# EAGLE design led (EAGLE 6.4)
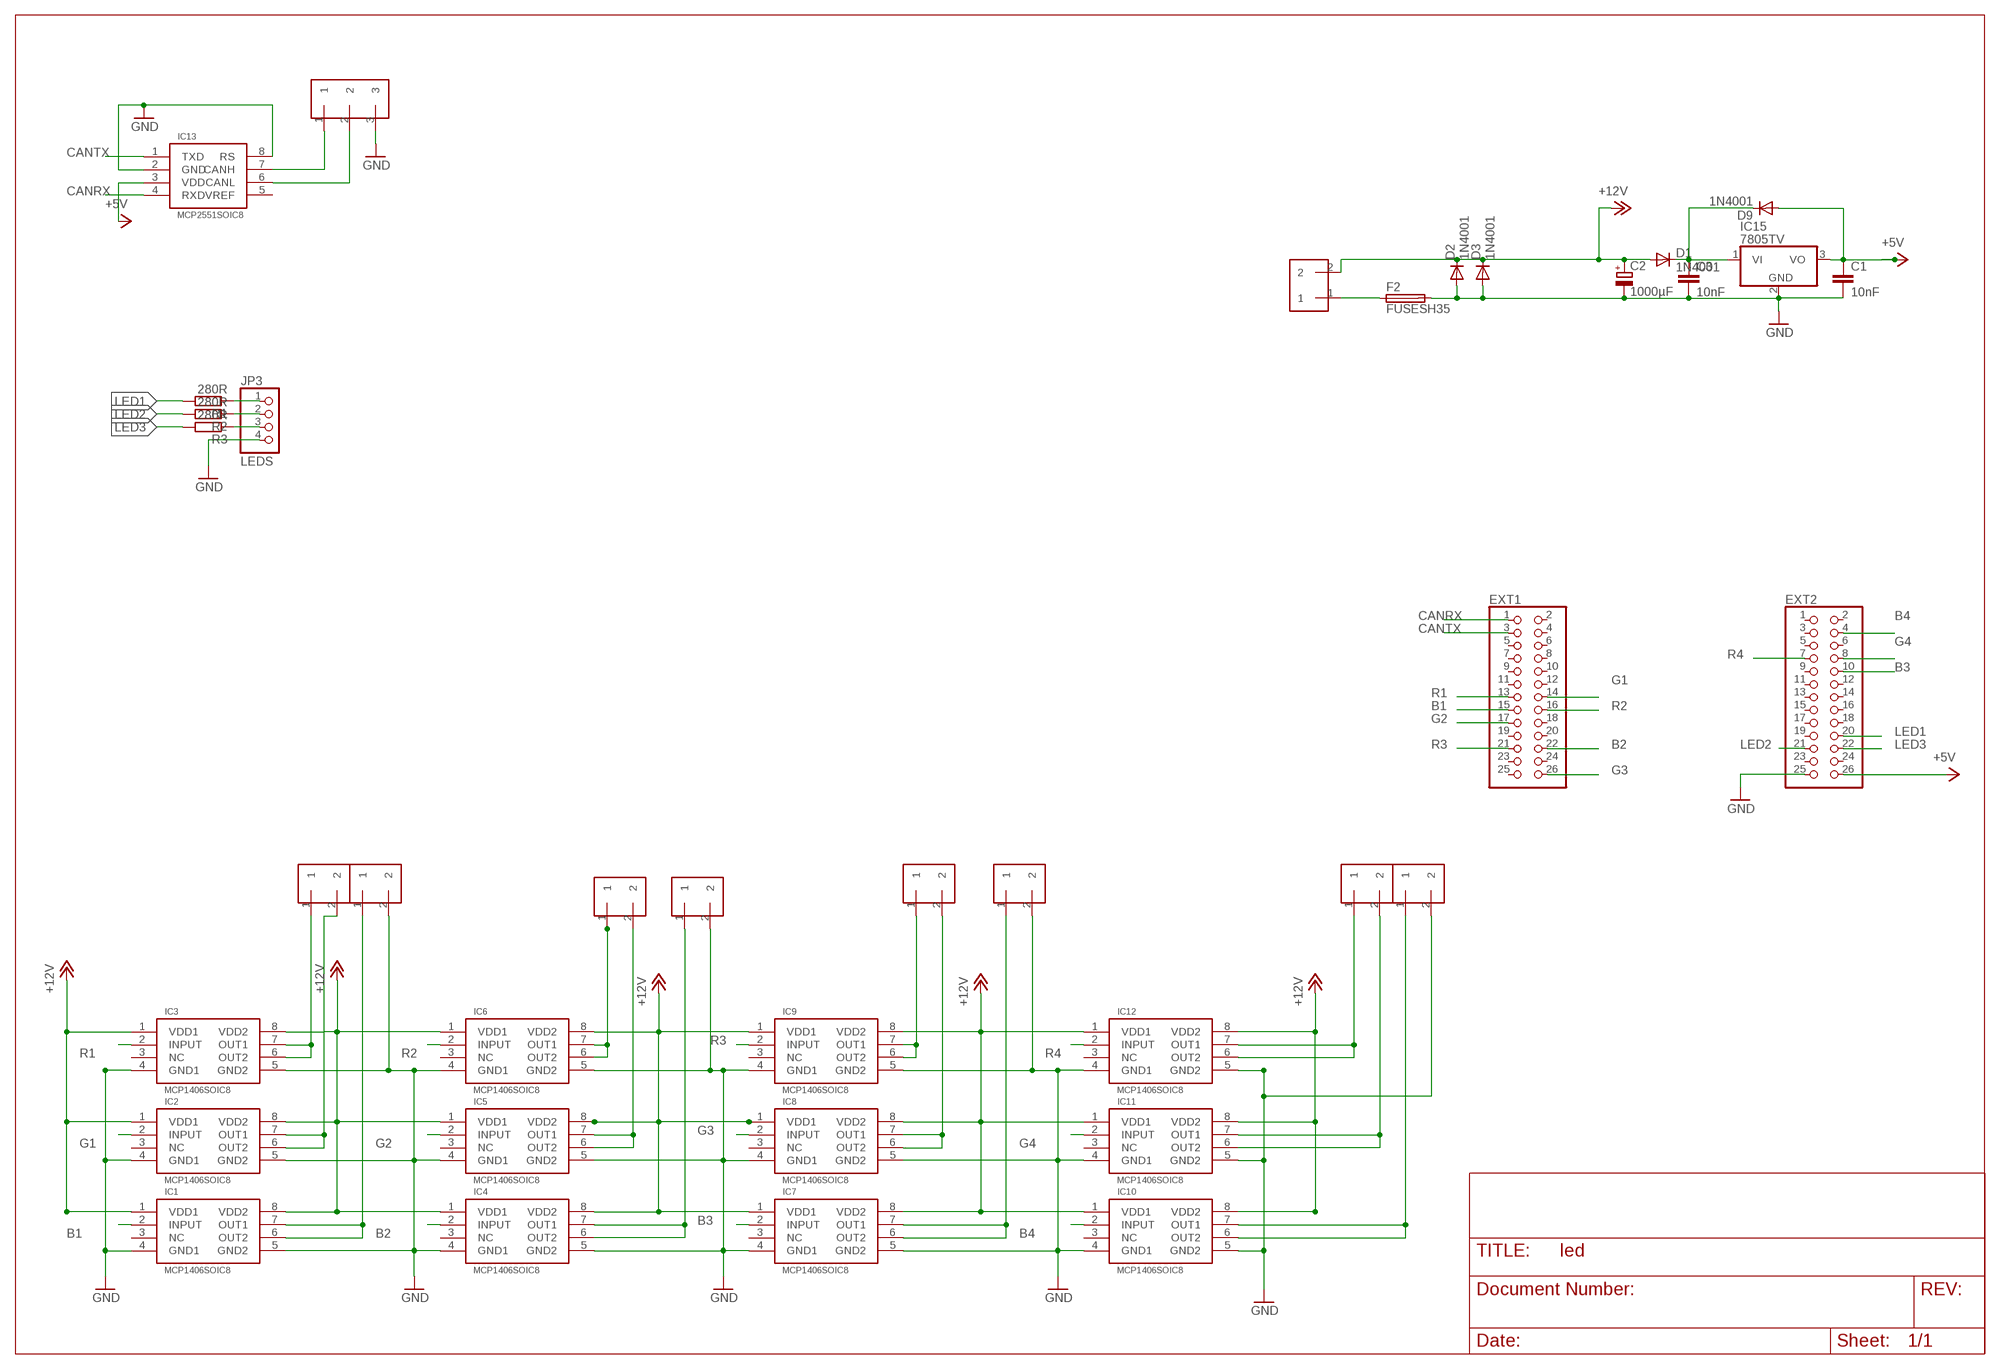
[diagram p0: schematic, sheet 1]

## Parts
C1  10nF  C-EU025-025X050  [C025-025X050]
C2  1000µF  CPOL-EUE5-8.5  [E5-8,5]
C3  10nF  C-EU025-025X050  [C025-025X050]
D1  1N4001  DIODE-MELF-MLL41  [MELF-MLL41]
D2  1N4001  DIODE-MELF-MLL41  [MELF-MLL41]
D3  1N4001  DIODE-MELF-MLL41  [MELF-MLL41]
D9  1N4001  DIODE-MELF-MLL41  [MELF-MLL41]
EXT1  PINHD-2X13  [2X13]
EXT2  PINHD-2X13  [2X13]
F2  FUSESH35  [SH25]
IC1  MCP1406SOIC8  [SOIC-08LG]
IC2  MCP1406SOIC8  [SOIC-08LG]
IC3  MCP1406SOIC8  [SOIC-08LG]
IC4  MCP1406SOIC8  [SOIC-08LG]
IC5  MCP1406SOIC8  [SOIC-08LG]
IC6  MCP1406SOIC8  [SOIC-08LG]
IC7  MCP1406SOIC8  [SOIC-08LG]
IC8  MCP1406SOIC8  [SOIC-08LG]
IC9  MCP1406SOIC8  [SOIC-08LG]
IC10  MCP1406SOIC8  [SOIC-08LG]
IC11  MCP1406SOIC8  [SOIC-08LG]
IC12  MCP1406SOIC8  [SOIC-08LG]
IC13  MCP2551SOIC8  [SOIC-08LG]
IC15  7805TV  [TO220V]
JP3  LEDS  PINHD-1X4  [1X04]
R1  280R  R-EU_0204/7  [0204/7]
R2  280R  R-EU_0204/7  [0204/7]
R3  280R  R-EU_0204/7  [0204/7]
U$1  2KLEMME  [W237-102]
U$2  2KLEMME  [W237-102]
U$3  3KLEMME  [W237-103]
U$5  2KLEMME  [W237-102]
U$6  2KLEMME  [W237-102]
U$7  2KLEMME  [W237-102]
U$8  2KLEMME  [W237-102]
U$9  2KLEMME  [W237-102]
U$10  2KLEMME  [W237-102]
U$11  2KLEMME  [W237-102]

## Nets
+5V: C1.1 D9.A EXT2.26 IC13.3(VDD) IC15.3(VO)
+12V: C2.+ D1.A D2.C D3.C IC1.1(VDD1) IC1.8(VDD2) IC2.1(VDD1) IC2.8(VDD2) IC3.1(VDD1) IC3.8(VDD2) IC4.1(VDD1) IC4.8(VDD2) IC5.1(VDD1) IC5.8(VDD2) IC6.1(VDD1) IC6.8(VDD2) IC7.1(VDD1) IC7.8(VDD2) IC8.1(VDD1) IC8.8(VDD2) IC9.1(VDD1) IC9.8(VDD2) IC10.1(VDD1) IC10.8(VDD2) IC11.1(VDD1) IC11.8(VDD2) IC12.1(VDD1) IC12.8(VDD2) U$1.2
B1: EXT1.15 IC1.2(INPUT)
B2: EXT1.22 IC4.2(INPUT)
B3: EXT2.10 IC7.2(INPUT)
B4: EXT2.4 IC10.2(INPUT)
CANH: IC13.7(CANH) U$3.1
CANL: IC13.6(CANL) U$3.2
CANRX: EXT1.1 IC13.4(RXD)
CANTX: EXT1.3 IC13.1(TXD)
G1: EXT1.14 IC2.2(INPUT)
G2: EXT1.17 IC5.2(INPUT)
G3: EXT1.26 IC8.2(INPUT)
G4: EXT2.8 IC11.2(INPUT)
GND: C1.2 C2.- C3.2 D2.A D3.A EXT2.25 F2.2 IC1.4(GND1) IC1.5(GND2) IC2.4(GND1) IC2.5(GND2) IC3.4(GND1) IC3.5(GND2) IC4.4(GND1) IC4.5(GND2) IC5.4(GND1) IC5.5(GND2) IC6.4(GND1) IC6.5(GND2) IC7.4(GND1) IC7.5(GND2) IC8.4(GND1) IC8.5(GND2) IC9.4(GND1) IC9.5(GND2) IC10.4(GND1) IC10.5(GND2) IC11.4(GND1) IC11.5(GND2) IC12.4(GND1) IC12.5(GND2) IC13.2(GND) IC13.8(RS) IC15.2(GND) JP3.4 U$2.2 U$3.3 U$6.2 U$7.2 U$11.2
LED1: EXT2.20 R1.2
LED2: EXT2.21 R2.2
LED3: EXT2.22 R3.2
N$1: C3.1 D1.C D9.C IC15.1(VI)
N$2: F2.1 U$1.1
N$3: IC3.6(OUT2) IC3.7(OUT1) U$5.1
N$4: IC2.6(OUT2) IC2.7(OUT1) U$5.2
N$5: IC1.6(OUT2) IC1.7(OUT1) U$6.1
N$6: IC6.6(OUT2) IC6.7(OUT1) U$10.1
N$7: IC5.6(OUT2) IC5.7(OUT1) U$10.2
N$8: IC4.6(OUT2) IC4.7(OUT1) U$11.1
N$9: IC9.6(OUT2) IC9.7(OUT1) U$8.1
N$10: IC8.6(OUT2) IC8.7(OUT1) U$8.2
N$11: IC7.6(OUT2) IC7.7(OUT1) U$7.1
N$12: IC12.6(OUT2) IC12.7(OUT1) U$9.1
N$13: IC11.6(OUT2) IC11.7(OUT1) U$9.2
N$14: IC10.6(OUT2) IC10.7(OUT1) U$2.1
N$32: JP3.1 R1.1
N$36: JP3.2 R2.1
N$37: JP3.3 R3.1
R1: EXT1.13 IC3.2(INPUT)
R2: EXT1.16 IC6.2(INPUT)
R3: EXT1.21 IC9.2(INPUT)
R4: EXT2.7 IC12.2(INPUT)
Unconnected: EXT1.2 EXT1.4 EXT1.5 EXT1.6 EXT1.7 EXT1.8 EXT1.9 EXT1.10 EXT1.11 EXT1.12 EXT1.18 EXT1.19 EXT1.20 EXT1.23 EXT1.24 EXT1.25 EXT2.1 EXT2.2 EXT2.3 EXT2.5 EXT2.6 EXT2.9 EXT2.11 EXT2.12 EXT2.13 EXT2.14 EXT2.15 EXT2.16 EXT2.17 EXT2.18 EXT2.19 EXT2.23 EXT2.24 IC1.3(NC) IC2.3(NC) IC3.3(NC) IC4.3(NC) IC5.3(NC) IC6.3(NC) IC7.3(NC) IC8.3(NC) IC9.3(NC) IC10.3(NC) IC11.3(NC) IC12.3(NC) IC13.5(VREF)

## Library data of the parts
C1 C3 = rcl:C-EU: CAPACITOR, European symbol
C2 = rcl:CPOL-EU: POLARIZED CAPACITOR, European symbol
D1-D3 D9 = diode:DIODE-: DIODE
EXT1 EXT2 = pinhead:PINHD-2X13: PIN HEADER
F2 = fuse:FUSE: Fuse; OC_FARNELL: unknown; OC_NEWARK: unknown
IC1-IC12 = custom-parts:MCP1406
IC13 = custom-parts:MCP2551
IC15 = linear:78*: Positive VOLTAGE REGULATOR Source: http://cache.national.com/ds/LM/LM78L05.pdf http://www.fairchildsemi.com/ds/LM/LM7805.pdf
JP3 = pinhead:PINHD-1X4: PIN HEADER
R1-R3 = rcl:R-EU_: RESISTOR, European symbol
U$1 U$2 U$5-U$11 = custom-parts:2KLEMME
U$3 = custom-parts:3KLEMME

## Board
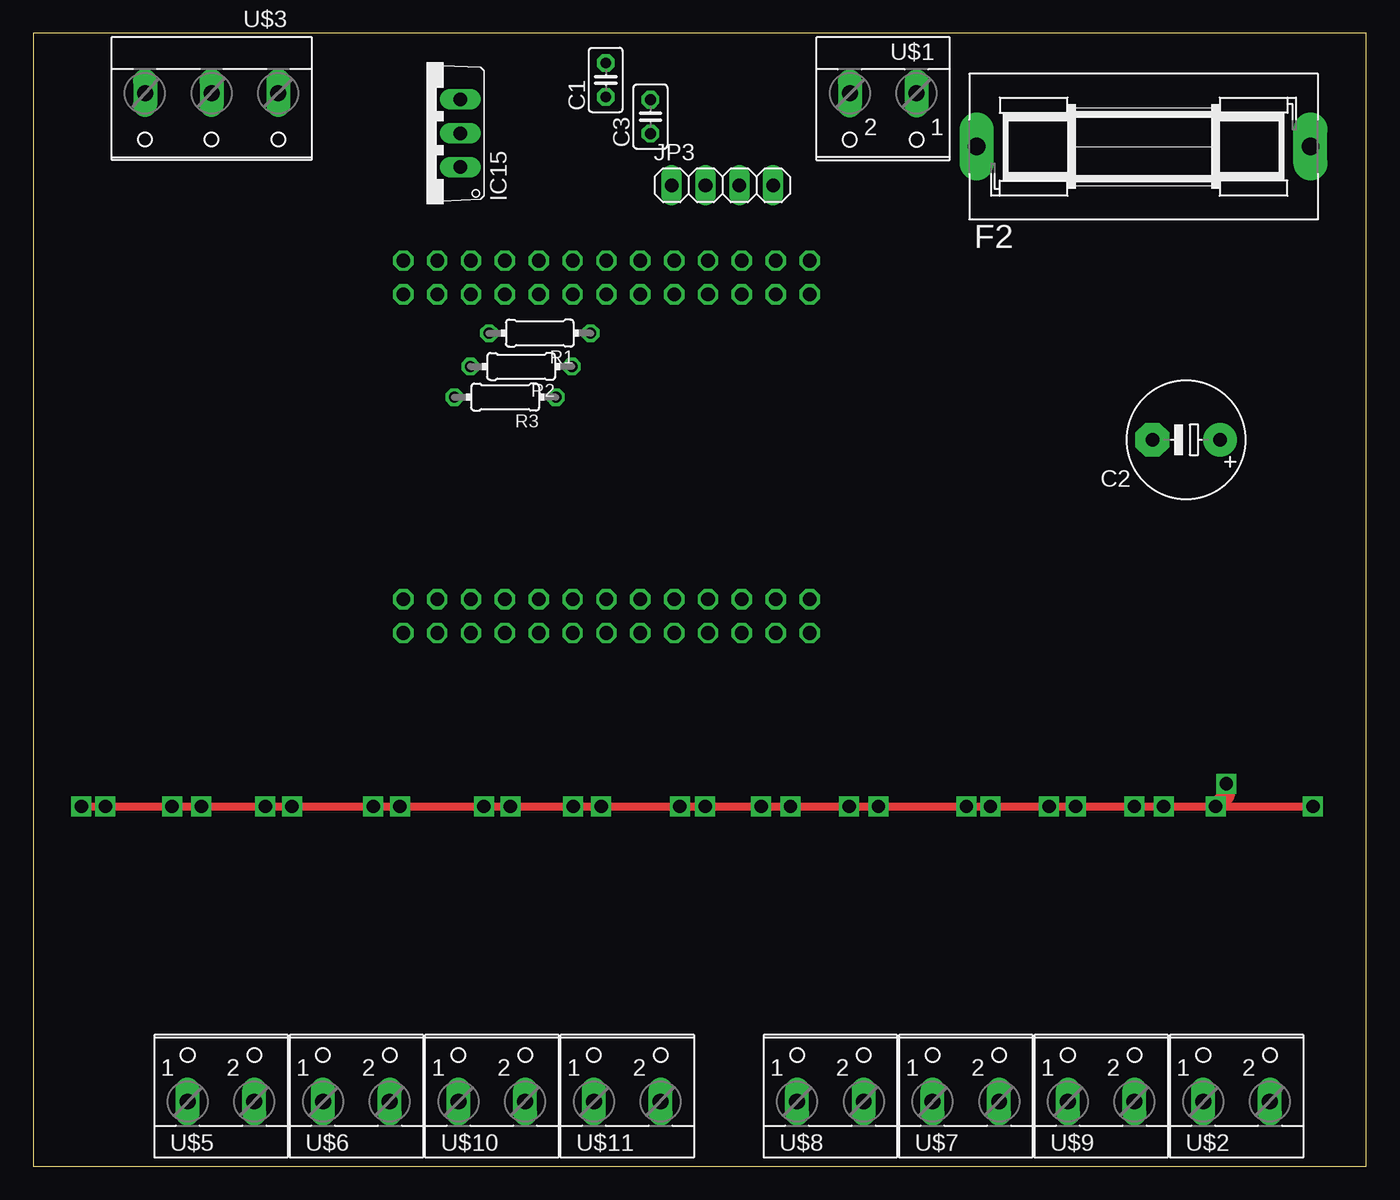
[diagram p1: board, top side]
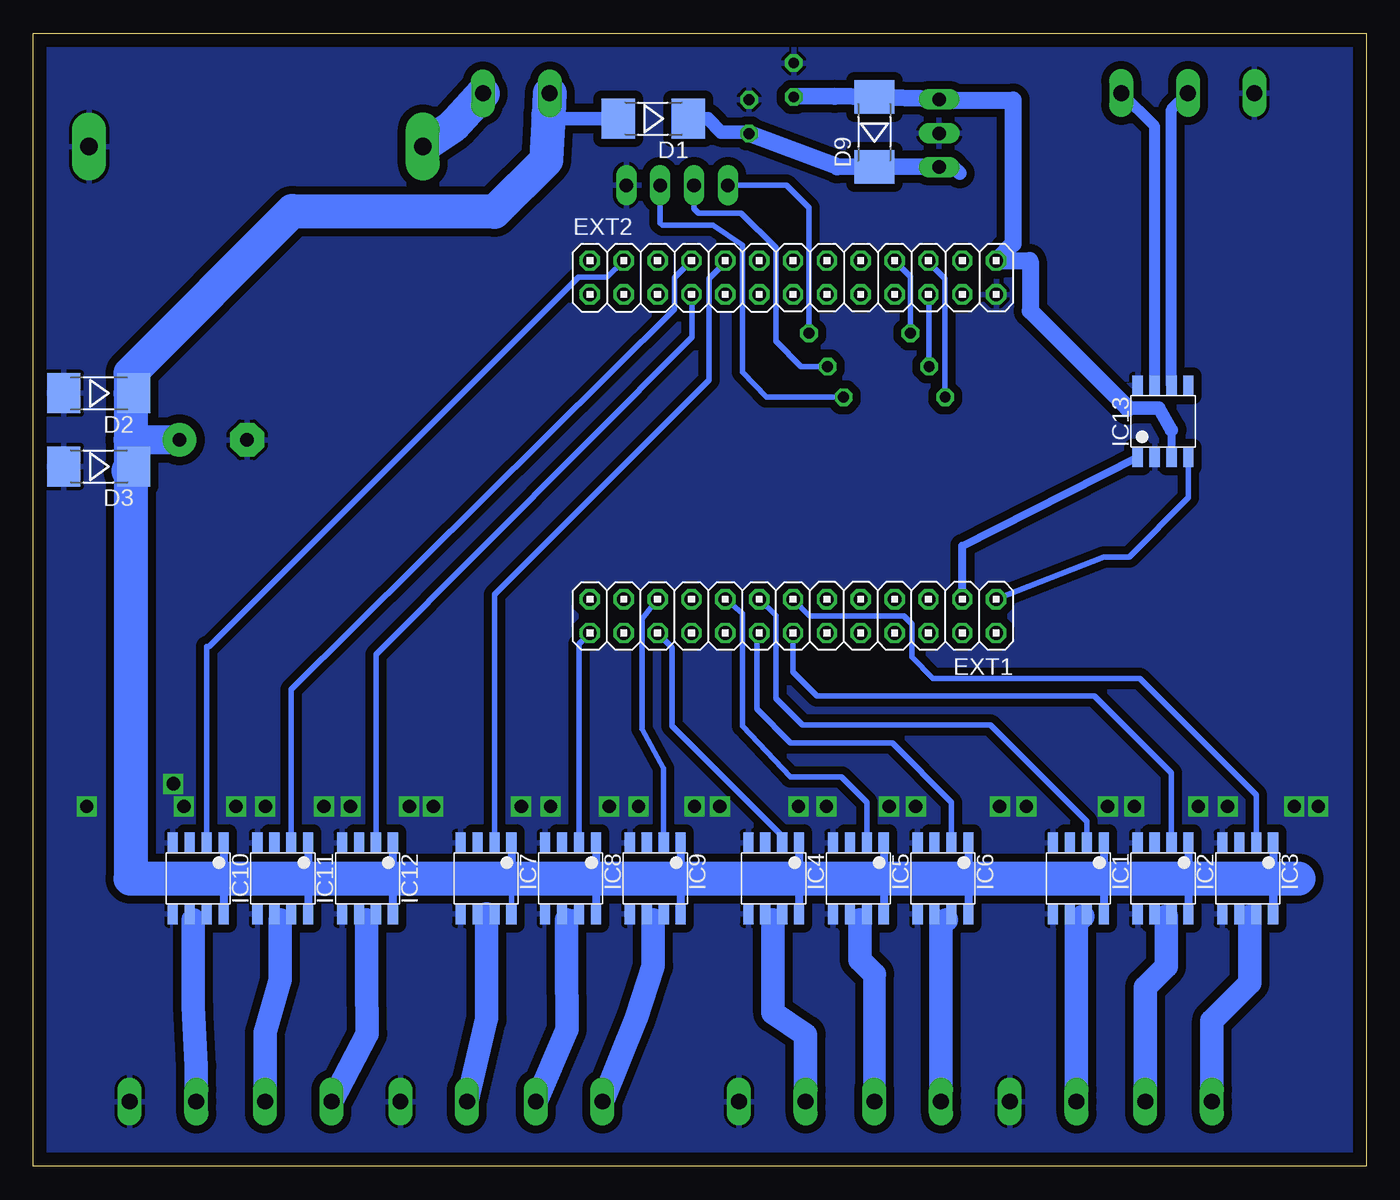
[diagram p2: board, bottom side, seen from below]

Size 100 x 85 mm. Coordinates in mm from the lower left corner, seen from the top.
Outline: 0,0 100,0 100,85 0,85 0,0
Copper layers (1*16): Top 0.035mm / dielectric 1.5mm / Bottom 0.035mm
Design rules "default": minimum track width 10mil, minimum drill 24mil, track to track 8mil, track to pad 8mil, pad to pad 8mil, via to via 8mil, smd to smd 8mil, copper to edge 40mil, drill to drill 8mil, minimum pad ring 10mil, minimum via ring 8mil, stop-mask expansion 4mil, vias tented up to drill 0mil, thermal gap 10mil

### Footprints (pad centres in the part's own frame; a part is rotated, then mirrored left to right if it is on the bottom)
C025-025X050 = drill 0.813 octagon: 1 -1.27,0; 2 1.27,0
E5-8,5 = drill 1.016 pad 2.54: + -2.54,0 | drill 1.016 pad 2.54 octagon: - 2.54,0
MELF-MLL41 = smd 2.5 x 3: A 2.625,0; C -2.625,0
2X13 = drill 1.016 octagon: 1 -15.24,-1.27; 2 -15.24,1.27; 3 -12.7,-1.27; 4 -12.7,1.27; 5 -10.16,-1.27; 6 -10.16,1.27; 7 -7.62,-1.27; 8 -7.62,1.27; 9 -5.08,-1.27; 10 -5.08,1.27; 11 -2.54,-1.27; 12 -2.54,1.27; 13 0,-1.27; 14 0,1.27; 15 2.54,-1.27; 16 2.54,1.27; 17 5.08,-1.27; 18 5.08,1.27; 19 7.62,-1.27; 20 7.62,1.27; 21 10.16,-1.27; 22 10.16,1.27; 23 12.7,-1.27; 24 12.7,1.27; 25 15.24,-1.27; 26 15.24,1.27
SH25 = drill 1.321 pad 2.54 long: 1 -12.522,0; 2 12.522,0
SOIC-08LG = smd 0.762 x 1.524: 1 -1.905,-2.675; 2 -0.635,-2.675; 3 0.635,-2.675; 4 1.905,-2.675; 5 1.905,2.675; 6 0.635,2.675; 7 -0.635,2.675; 8 -1.905,2.675
TO220V = drill 1.016 long: 1 -2.54,-2.54; 2 0,-2.54; 3 2.54,-2.54
1X04 = drill 1.016 long: 1 -3.81,0; 2 -1.27,0; 3 1.27,0; 4 3.81,0
0204/7 = drill 0.813 octagon: 1 -3.81,0; 2 3.81,0
W237-102 = drill 1.194 long: 1 -2.5,0; 2 2.5,0
W237-103 = drill 1.194 long: 1 -5,-0.02; 2 0,-0.02; 3 5,-0.02

### Placement (x,y rotation side)
C1  42.95,81.5 90 top
C2  86.5,54.5 180 top
C3  46.3,78.75 90 top
D1  53.5,78.6 180 bottom
D2  95.1,58 180 bottom
D3  95.1,52.5 180 bottom
D9  36.9,77.6 90 bottom
EXT1  43,41.27 180 bottom
EXT2  43,66.67 0 bottom
F2  83.3,76.5 0 top
IC1  21.59,21.59 180 bottom
IC2  15.24,21.59 180 bottom
IC3  8.89,21.59 180 bottom
IC4  44.45,21.59 180 bottom
IC5  38.1,21.59 180 bottom
IC6  31.75,21.59 180 bottom
IC7  66.04,21.59 180 bottom
IC8  59.69,21.59 180 bottom
IC9  53.34,21.59 180 bottom
IC10  87.63,21.59 180 bottom
IC11  81.28,21.59 180 bottom
IC12  74.93,21.59 180 bottom
IC13  15.24,55.88 0 bottom
IC15  29.5,77.5 90 top
JP3  51.7,73.6 0 top
R1  38,62.5 180 top
R2  36.6,60 180 top
R3  35.4,57.7 180 top
U$1  63.76,80.5 180 top
U$2  90.28,4.85 0 top
U$3  13.38,80.5 180 top
U$5  14.08,4.85 0 top
U$6  24.24,4.85 0 top
U$7  69.96,4.85 0 top
U$8  59.8,4.85 0 top
U$9  80.12,4.85 0 top
U$10  34.4,4.85 0 top
U$11  44.56,4.85 0 top

### Tracks (layer width: path | path; a pad name or v marks a point on that pad's centre or on a via)
+5V
  Bottom 0.406: IC15.3 31,80.04 D9.A
  Bottom 0.61: 14.61,55.24 IC13.3
  Bottom 1.016: 17.9,56.88 15.54,56.88 14.61,55.24
  Bottom 1.27: IC15.3 39.89,80.27 C1.1 | 31,80.04 31,80 26.5,80 26.5,69.2 EXT2.26 25.25,67.94 25.2,67.9 25.2,64.18 17.9,56.88
+12V
  Bottom 0.406: IC7.8 IC7.1
  Bottom 0.61: IC3.1 IC3.8 6.99,21.59 7.62,21.59 | IC2.8 IC2.1 13.34,21.59 13.97,21.59 | IC1.8 IC1.1 19.68,21.59 20.32,21.59 | IC6.8 IC6.1 29.84,21.59 30.48,21.59 | IC5.8 IC5.1 36.2,21.59 36.83,21.59 | IC4.8 IC4.1 42.55,21.59 43.18,21.59 | IC9.8 IC9.1 51.44,21.59 50.8,21.59 | IC8.8 IC8.1 57.78,21.59 58.42,21.59 | IC12.8 IC12.1 73.03,21.59 73.66,21.59 | IC11.8 IC11.1 79.38,21.59 80.01,21.59 | IC10.8 IC10.1 85.72,21.59 85.09,21.59 | IC7.1 64.14,21.59 64.77,21.59
  Bottom 1.016: D1.A 61.09,78.6 61.36,78.87
  Bottom 2.184: C2.+ 92.71,54.5
  Bottom 2.54: 92.71,58 92.71,59.5 80.61,71.61 | 92.71,58 92.71,54.5 92.71,52 | 92.71,52 92.71,21.59 85.09,21.59 80.01,21.59 73.66,21.59 64.77,21.59 58.42,21.59 50.8,21.59 43.18,21.59 36.83,21.59 30.48,21.59 20.32,21.59 13.97,21.59 7.62,21.59 5.08,21.59 | 80.55,71.66 80.61,71.61 | D2.C 92.71,58 | D3.C 92.88,52.16 92.71,52 | U$1.2 61.36,78.87 61.55,75.55 61.5,75.5 65.39,71.61 80.61,71.61
B1
  Bottom 0.406: EXT1.15 44.3,41.3 44.3,35.1 42.3,33.1 28.2,33.1 20.95,25.86 IC1.2
B2
  Bottom 0.406: EXT1.22 52.07,38.91 52.07,33.02 43.81,24.77 IC4.2
B3
  Bottom 0.406: EXT2.10 48.08,67.82 49.3,66.6 49.3,59 65.4,42.9 IC7.2
B4
  Bottom 0.406: IC10.2 87,39.01 86.8,39.01 59.1,66.7 56.95,66.7 EXT2.4
CANH
  Bottom 0.813: IC13.7 15.88,78.02 U$3.1
CANL
  Bottom 0.813: IC13.6 14.61,79.3 U$3.2
CANRX
  Bottom 0.406: EXT1.1 19.68,45.72 17.78,45.72 13.34,50.16 IC13.4
CANTX
  Bottom 0.61: EXT1.3 30.3,46.55 IC13.1
G1
  Bottom 0.406: EXT1.14 43,37.1 41.2,35.3 20.4,35.3 14.61,29.5 IC2.2
G2
  Bottom 0.406: EXT1.17 46.79,41.45 46.79,33.02 43.18,29.21 39.37,29.21 37.47,27.3 IC5.2
G3
  Bottom 0.406: EXT1.26 59.05,39.19 IC8.2
G4
  Bottom 0.406: EXT2.8 51.9,66.67 51.9,64.3 80.64,35.76 IC11.2
GND  (via drill 1 pad 1.27)
  Top 0.61: v3.6,27 v5.4,27 v10.4,27 v12.6,27 v17.4,27 v19.4,27 v25.5,27 v27.5,27 v33.8,27 v35.8,27 v40.5,27 v42.6,27 v48.5,27 v50.4,27 v54.6,27 v56.8,27 v61.2,27 v63.4,27 v70,27 v71.8,27 v76.2,27 v78.2,27 v82.6,27 v84.8,27 v88.7,27 v96,27
  Top 1.27: v89.5,28.7 89.5,27.8 v88.7,27
  pour Bottom (isolate 0.61): -5.08,90.17 104.14,88.9 104.14,-13.97 -5.08,-12.7
LED1
  Bottom 0.406: R1.2 34.19,66.75 EXT2.20
LED2
  Bottom 0.406: R2.2 32.79,65.36 EXT2.21
LED3
  Bottom 0.406: EXT2.22 32.84,67.84 31.6,66.6 R3.2
N$1
  Bottom 1.016: IC15.1 31,74.96 | 31,74.96 30.96,74.96 30.5,74.5 | D9.C 31,74.96 | D1.C 49.4,78.6 48.4,77.6 46.42,77.6 C3.1
  Bottom 1.27: IC15.1 39.68,74.98 C3.1
N$2
  Bottom 2.54: U$1.1 68.56,78 F2.1
N$3
  Bottom 0.61: IC3.6 8.91,18.91 8.75,18.75 8.42,18.75 IC3.7
  Bottom 1.778: U$5.1 11.58,10.92 8.75,13.75 8.75,18.75
N$4
  Bottom 0.61: IC2.7 14.84,18.91 15,18.75 15.71,18.75 IC2.6
  Bottom 1.778: U$5.2 16.58,13.42 15,15 15,18.75
N$5
  Bottom 0.61: 21.25,18.75 21.12,18.75 IC1.7 IC1.6
  Bottom 1.778: U$6.1 21.74,18.26 21.25,18.75
N$6
  Bottom 0.61: 31.5,18.5 31.5,18.53 IC6.7 IC6.6
  Bottom 1.778: U$10.1 31.9,18.1 31.5,18.5
N$7
  Bottom 0.61: IC5.6 38.59,18.91 38.5,19 37.55,19 IC5.7 37.59,18.91 38,18.5
  Bottom 1.676: 36.9,14.4 U$10.2
  Bottom 1.778: 36.9,14.4 38,15.5 38,18.5
N$8
  Bottom 0.61: IC4.7 IC4.6 44.91,18.91 44.5,18.5
  Bottom 1.778: U$11.1 42.06,9.86 44.5,11.5 44.5,18.5
N$9
  Bottom 0.61: IC9.7 IC9.6 53.91,18.91 53.5,18.5
  Bottom 1.778: U$8.1 54.76,11.18 53.5,15 53.5,18.5
N$10
  Bottom 0.61: 60,18.5 60,19 | 60,19 59.14,19 IC8.7 | IC8.6 60.09,18.91 60,19
  Bottom 1.778: U$8.2 59.96,10.28 60,15.5 60,18.5
N$11
  Bottom 0.406: IC7.7 66,18.91 IC7.6
  Bottom 1.778: U$7.1 65.98,11.08 66,14.5 66,18.91
N$12
  Bottom 0.61: 75,18.5 75.42,18.91 IC12.6 IC12.7
  Bottom 1.778: U$9.1 74.94,9.94 75,14 75,18.5
N$13
  Bottom 0.61: IC11.7 81.08,18.91 81.5,18.5 IC11.6
  Bottom 1.778: U$9.2 82.62,10.04 81.5,14 81.5,18.5
N$14
  Bottom 0.61: IC10.6 88.27,18.77 88,18.5 87.41,18.5 IC10.7
  Bottom 1.778: U$2.1 87.78,7.5 88,12 88,18.5
N$32
  Bottom 0.406: R1.1 41.81,71.91 43.5,73.6 JP3.1
N$36
  Bottom 0.406: JP3.2 50.43,71.83 50.1,71.5 46.9,71.5 44.3,68.9 44.3,61.9 42.4,60 R2.1
N$37
  Bottom 0.406: JP3.3 52.97,70.77 52.8,70.6 49,70.6 46.8,69.1 46.8,59.6 45,57.7 R3.1
R1
  Bottom 0.406: EXT1.13 41.76,41.3 34.7,41.3 34.1,40.7 34.1,38.2 32.5,36.6 17,36.6 8.26,27.86 IC3.2
R2
  Bottom 0.406: EXT1.16 45.72,39.83 45.72,34.29 43.18,31.75 35.56,31.75 31.11,27.3 IC6.2
R3
  Bottom 0.406: EXT1.21 54.33,41.08 54.33,32.82 52.7,29.84 IC9.2
R4
  Bottom 0.406: EXT2.7 50.6,65.39 50.6,62.2 74.3,38.41 IC12.2